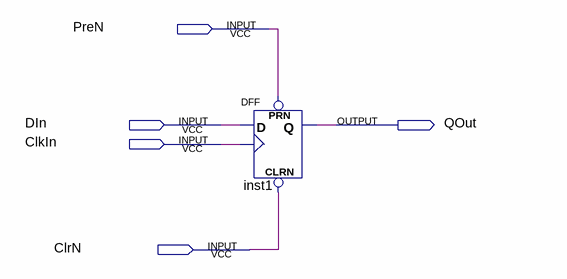
[diagram p0: schematic sheet]
// Quartus schematic MyFirstProject.bdf as structural Verilog: 1 symbols, 5 pins
module MyFirstProject (
  input  PreN,
  input  DIn,
  input  ClkIn,
  input  ClrN,
  output QOut
);

  DFF inst1 (.CLRN(ClrN), .CLK(ClkIn), .D(DIn), .PRN(PreN), .Q(QOut));
endmodule
